# Altium schematic sheet 神武L25手抄原理图.SchDoc
size A2
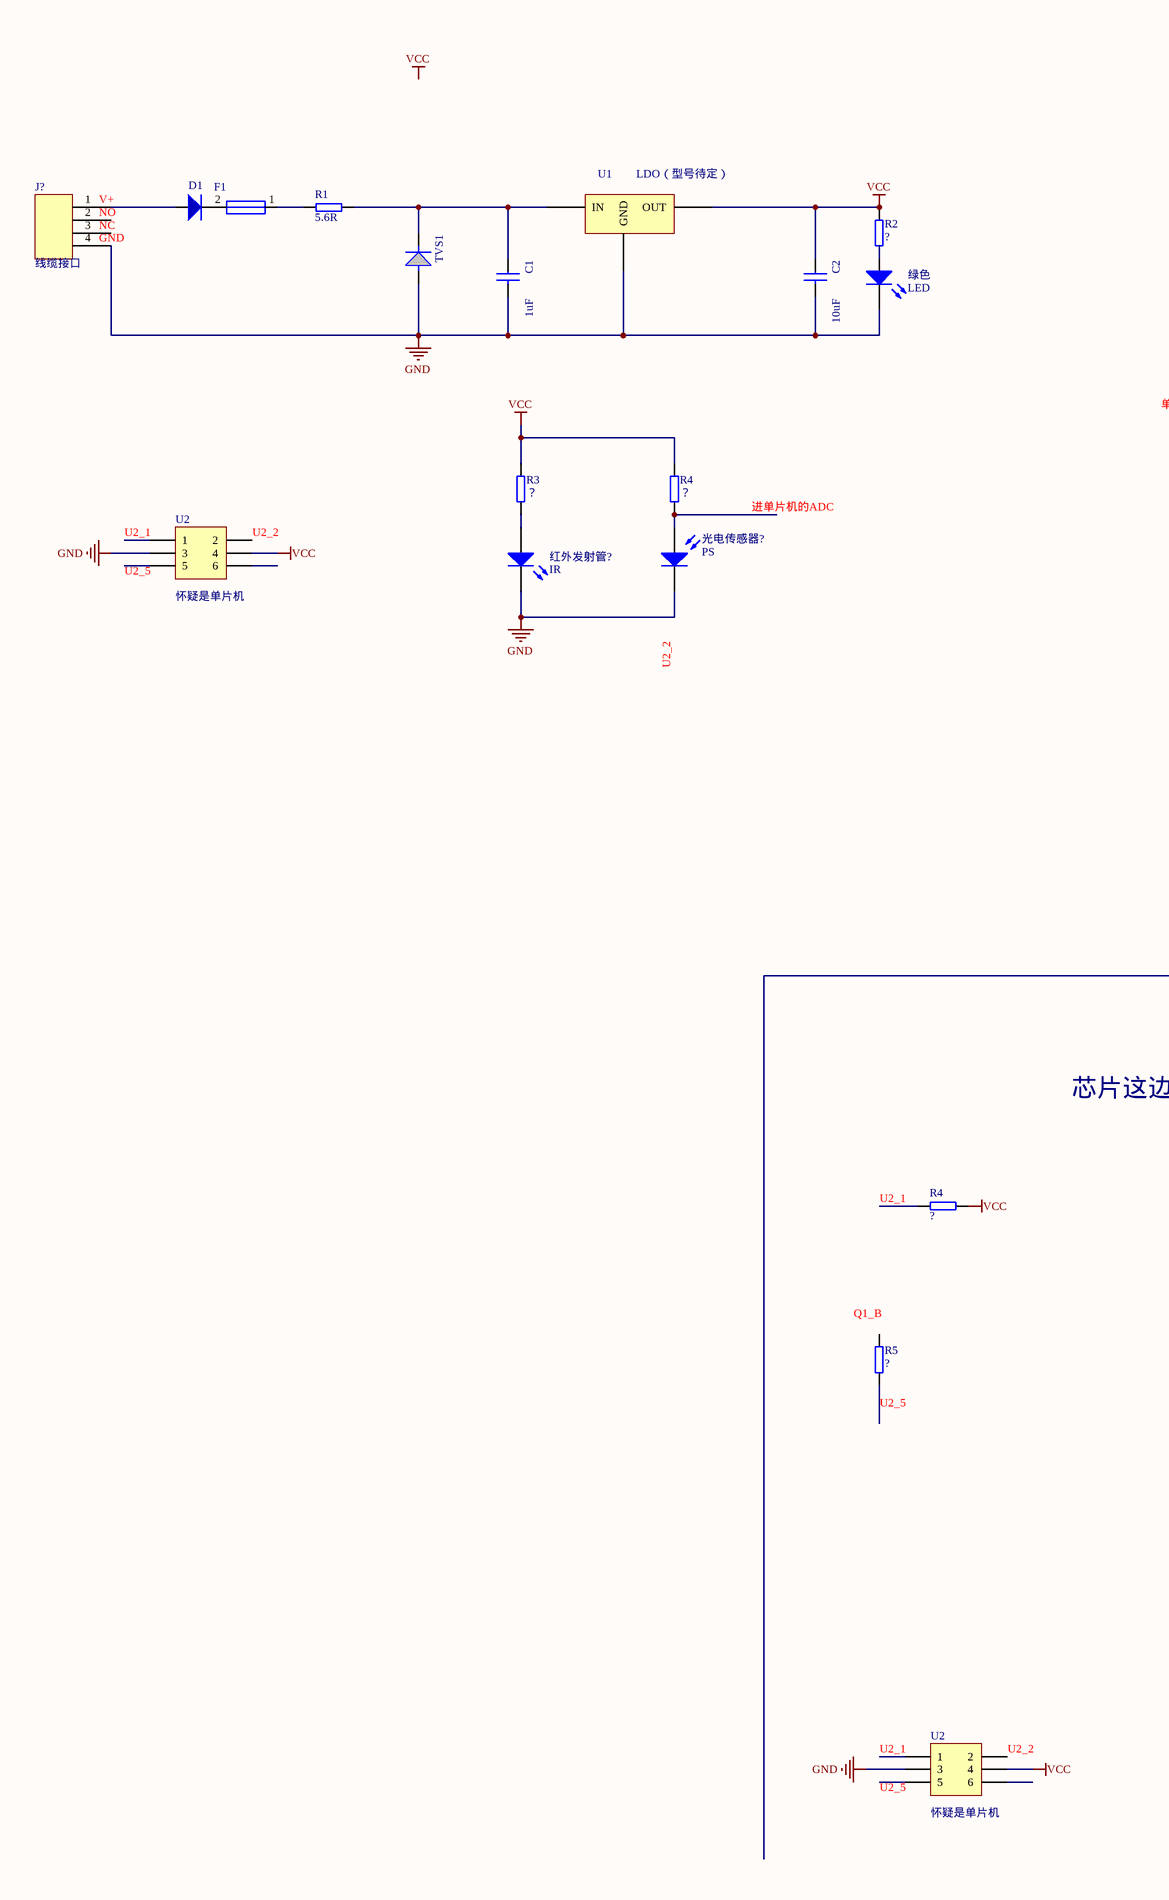
[diagram p0: 神武L25手抄原理图.SchDoc, left]
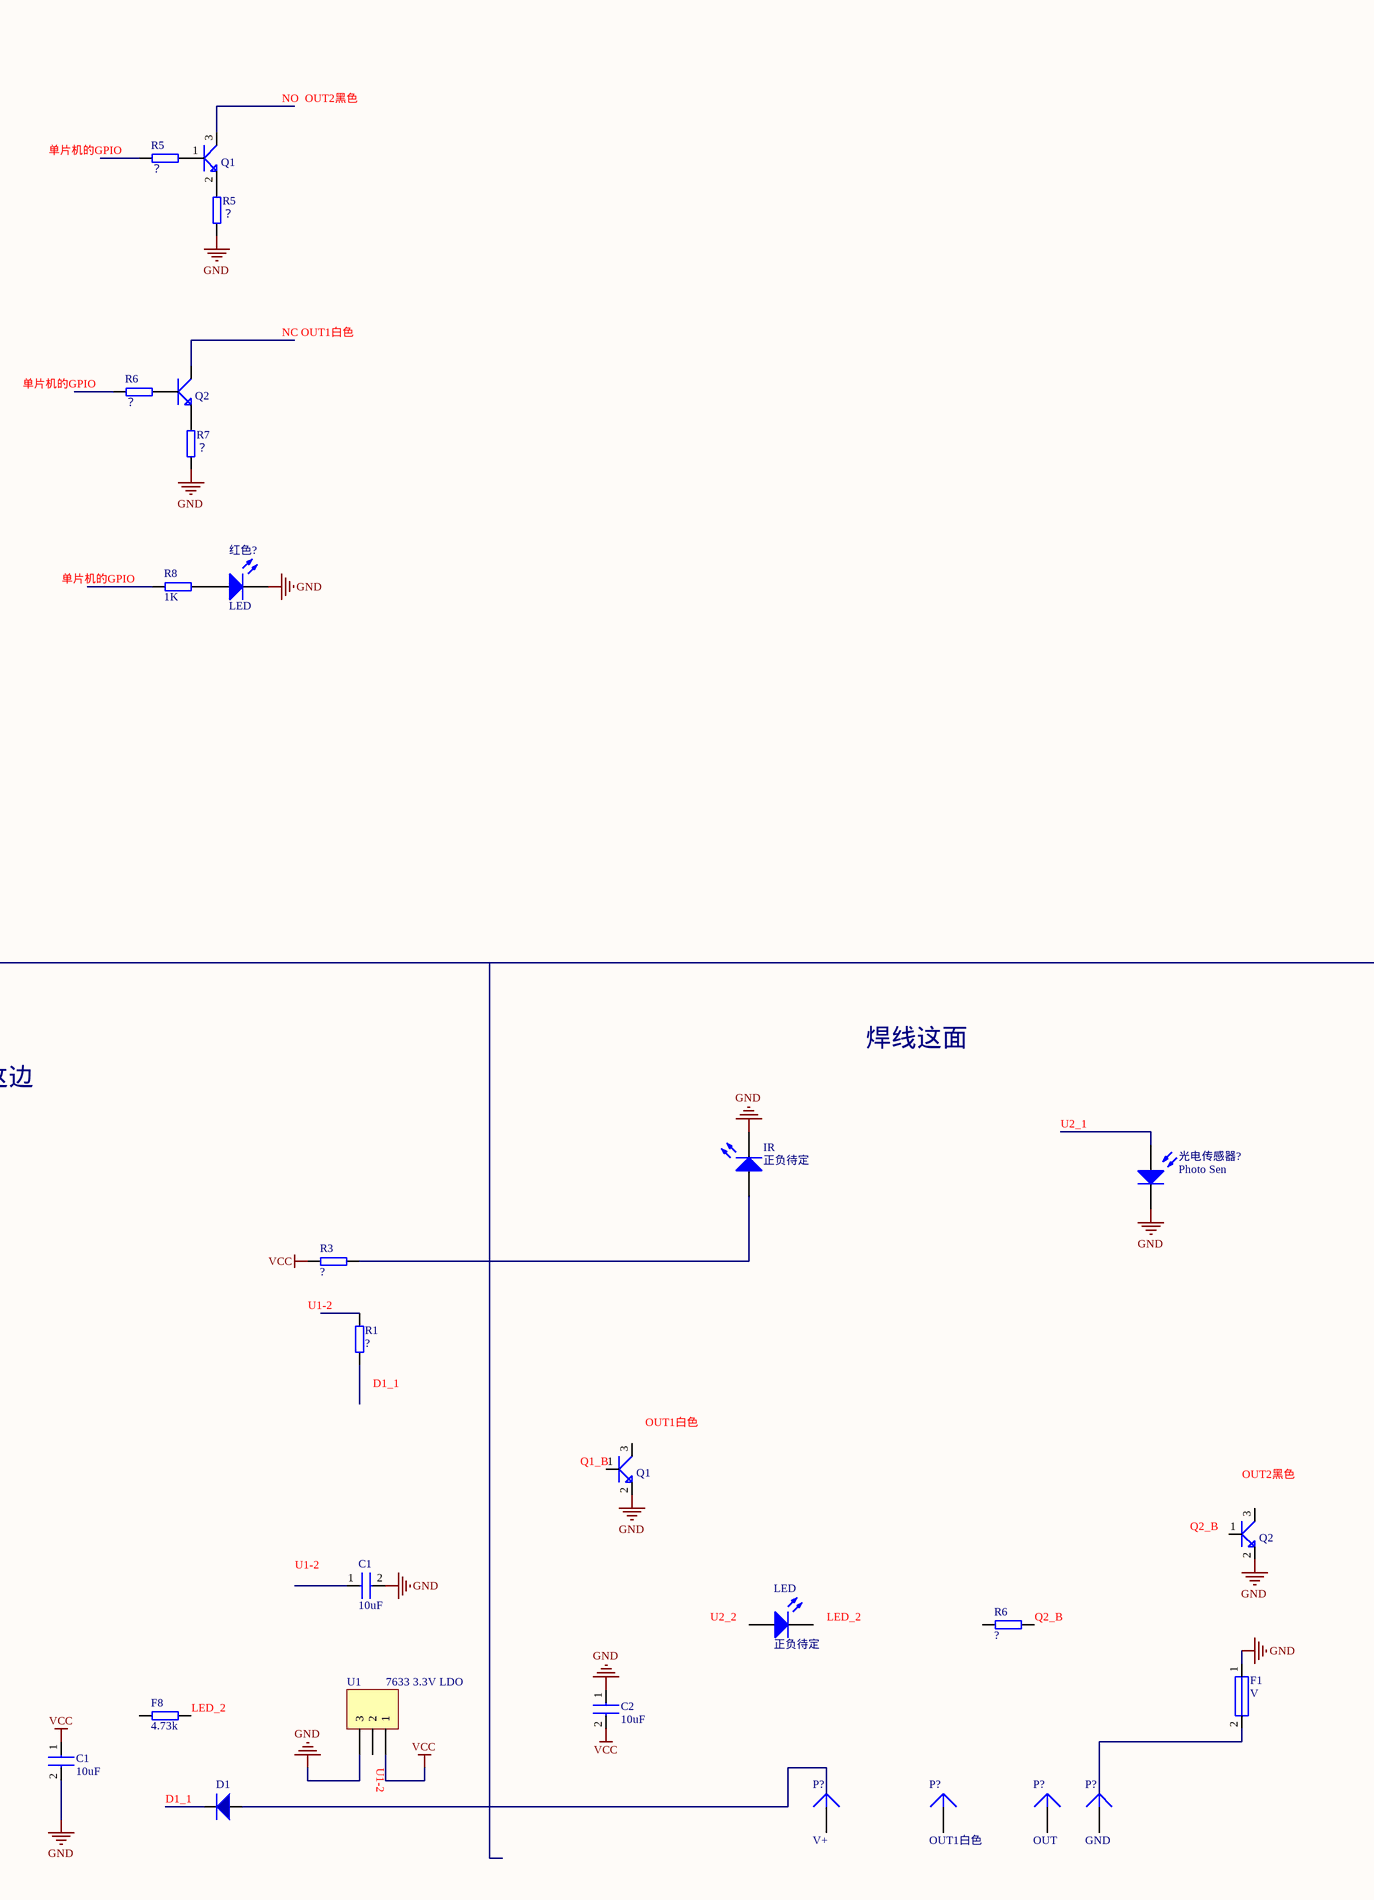
[diagram p1: 神武L25手抄原理图.SchDoc, right]

## Parts
(Parts that share a designator on the sheet are numbered #1, #2 ... from top to bottom, then left to right.)
C1#1  1uF  [1206]
C1#2  10uF
C1#3  10uF
C2#1  10uF  [1206]
C2#2  10uF
D1#1  (no value)
D1#2  (no value)
F1#1  V  [0805]  (value not drawn)
F1#2  V  [0805]
F8  4.73k
IR  正负待定  [LED-0]
J?  线缆接口  [SIP4]
LED  正负待定  [LED-0]
P?#1  V+  [PIN1]
P?#2  OUT1白色  [PIN1]
P?#3  OUT  [PIN1]
P?#4  GND  [PIN1]
Q1#1  2SC4617TLR  (value not drawn)
Q1#2  2SC4617TLR  (value not drawn)
Q2#1  2SC4617TLR  (value not drawn)
Q2#2  2SC4617TLR  (value not drawn)
R1#1  5.6R
R1#2  ?
R2  ?
R3#1  ？
R3#2  ?
R4#1  ？
R4#2  ?
R5#1  ？
R5#2  ？
R5#3  ?
R6#1  ？
R6#2  ?
R7  ？
R8  1K
TVS1  M1  [1206]  (value not drawn)
U1#1  LDO（型号待定）  [SOT89]
U1#2  7633 3.3V LDO  [HDR1X3]
U2#1  怀疑是单片机  [HDR2X3]
U2#2  怀疑是单片机  [HDR2X3]
光电传感器?#1  PS  [PIN2]
光电传感器?#2  Photo Sen  [PIN2]
红外发射管?  IR  [LED-0]
红色?  LED  [LED-0]
绿色  LED  [LED-0]

## Nets
GND: C1#1.2 C1#2.2 C1#3.2 C2#1.2 C2#2.1 F1#2.1 IR.2(K) J?.4 Q1#2.2(E) Q2#2.2(E) R5#2.2 R7.2 TVS1.1 U1#1.2(GND) U1#2.3 U2#1.3 U2#2.3 光电传感器?#1.2(K) 光电传感器?#2.2(K) 红外发射管?.2(K) 红色?.2(K) 绿色.2(K)
VCC: C1#3.1 C2#1.1 C2#2.2 R2.1 R3#1.1 R3#2.2 R4#1.1 R4#2.1 U1#1.1(OUT) U1#2.1 U2#1.4 U2#2.4
NetC1#1_1: C1#1.1 R1#1.1 TVS1.2 U1#1.3(IN)
NetD1#1_1: D1#1.1 J?.1
NetD1#1_2: D1#1.2 F1#1.2
NetF1#1_1: F1#1.1 R1#1.2
NetIR_1: IR.1(A) R3#2.1
NetQ1#1_1: Q1#1.1(B) R5#1.2
NetQ1#1_2: Q1#1.2(E) R5#2.1
NetQ2#1_1: Q2#1.1(B) R6#1.2
NetQ2#1_2: Q2#1.2(E) R7.1
NetR2_2: R2.2 绿色.1(A)
NetR3#1_2: R3#1.2 红外发射管?.1(A)
NetR4#1_2: R4#1.2 光电传感器?#1.1(A)
NetR8_2: R8.2 红色?.1(A)

Not connected (* = marked no-connect by the designer): C1#2 1; D1#2 1 2; F1#2 2; F8 1 2; J? 2 3; LED 1(A) 2(K); P?#1 1; P?#2 1; P?#3 1; P?#4 1; Q1#1 3(C); Q1#2 1(B) 3(C); Q2#1 3(C); Q2#2 1(B) 3(C); R1#2 1 2; R4#2 2; R5#1 1; R5#3 1 2; R6#1 1; R6#2 1 2; R8 1; U1#2 2; U2#1 1 2 5 6; U2#2 1 2 5 6; 光电传感器?#2 1(A)

## Notes on the sheet
- NO  OUT2黑色
- 单片机的GPIO
- (near J?) V+
- (near J?) NO
- (near J?) NC
- (near J?) GND
- NC OUT1白色
- 进单片机的ADC
- (near U2#1) U2_1
- (near U2#1) U2_5
- (near U2#1) U2_2
- U2_2
- 焊线这面
- 芯片这边
- U2_1
- (near R4#2) U2_1
- (near R5#3) Q1_B
- U1-2
- (near R5#3) U2_5
- (near R1#2) D1_1
- (near Q1#2) Q1_B
- (near Q1#2) OUT1白色
- (near Q2#2) Q2_B
- (near Q2#2) OUT2黑色
- (near C1#2) U1-2
- (near LED) U2_2
- (near LED) LED_2
- (near R6#2) Q2_B
- (near F8) LED_2
- (near U2#2) U2_1
- (near U2#2) U2_5
- (near U2#2) U2_2
- (near U1#2) U1-2
- (near D1#2) D1_1
- Labels drawn without touching a wire or pin: VCC

## Library data of the parts
C1#1 C2#1 = CAP NP: Text Field1: 20; Text Field2: 10
C1#2 C1#3 C2#2 = CAP
D1#1 D1#2 = D
F1#1 F1#2 = FUSE_0: Text Field1: 30; Text Field2: 20
F8 R1#1 R1#2 R2 R3#1 R3#2 R4#1 R4#2 R5#1-R5#3 R6#1 R6#2 R7 R8 = RES
IR LED 红外发射管? 红色? 绿色 = LED0: Typical INFRARED GaAs LED; Published: 8-Jun-2000; LatestRevisionDate: 08-Jul-2005; LatestRevisionNote: Mech Layer 1 removed.; PackageReference: LED-0; Publisher: Altium Limited; PackageDescription: LED; 2 Leads
J? = 4H
P?#1-P?#4 = Plug: LatestRevisionDate: 17-Jul-2002; LatestRevisionNote: Re-released for DXP Platform.; Publisher: Altium Limited
Q1#1 Q1#2 Q2#1 Q2#2 = 2SC4617
TVS1 = D1N3063_0: Text Field1: 20; Text Field2: 20
U1#1 = 78XX/SM_0: Text Field1: 70; Text Field2: 30
U1#2 = Header 3: Header, 3-Pin; LatestRevisionDate: 17-Jul-2002; LatestRevisionNote: Re-released for DXP Platform.; Publisher: Altium Limited
U2#1 U2#2 = Header 3X2: Header, 3-Pin, Dual row; LatestRevisionDate: 17-Jul-2002; LatestRevisionNote: Re-released for DXP Platform.; Publisher: Altium Limited
光电传感器?#1 光电传感器?#2 = Photo Sen: Photosensitive Diode; Published: 24-Mar-1999; LatestRevisionDate: 17-Jul-2002; LatestRevisionNote: Re-released for DXP Platform.; PackageReference: PIN2; Publisher: Altium Limited